# Altium schematic sheet Sheet1.SchDoc
size 431 x 279 mm; SheetNumber: 1; SheetTotal: 3
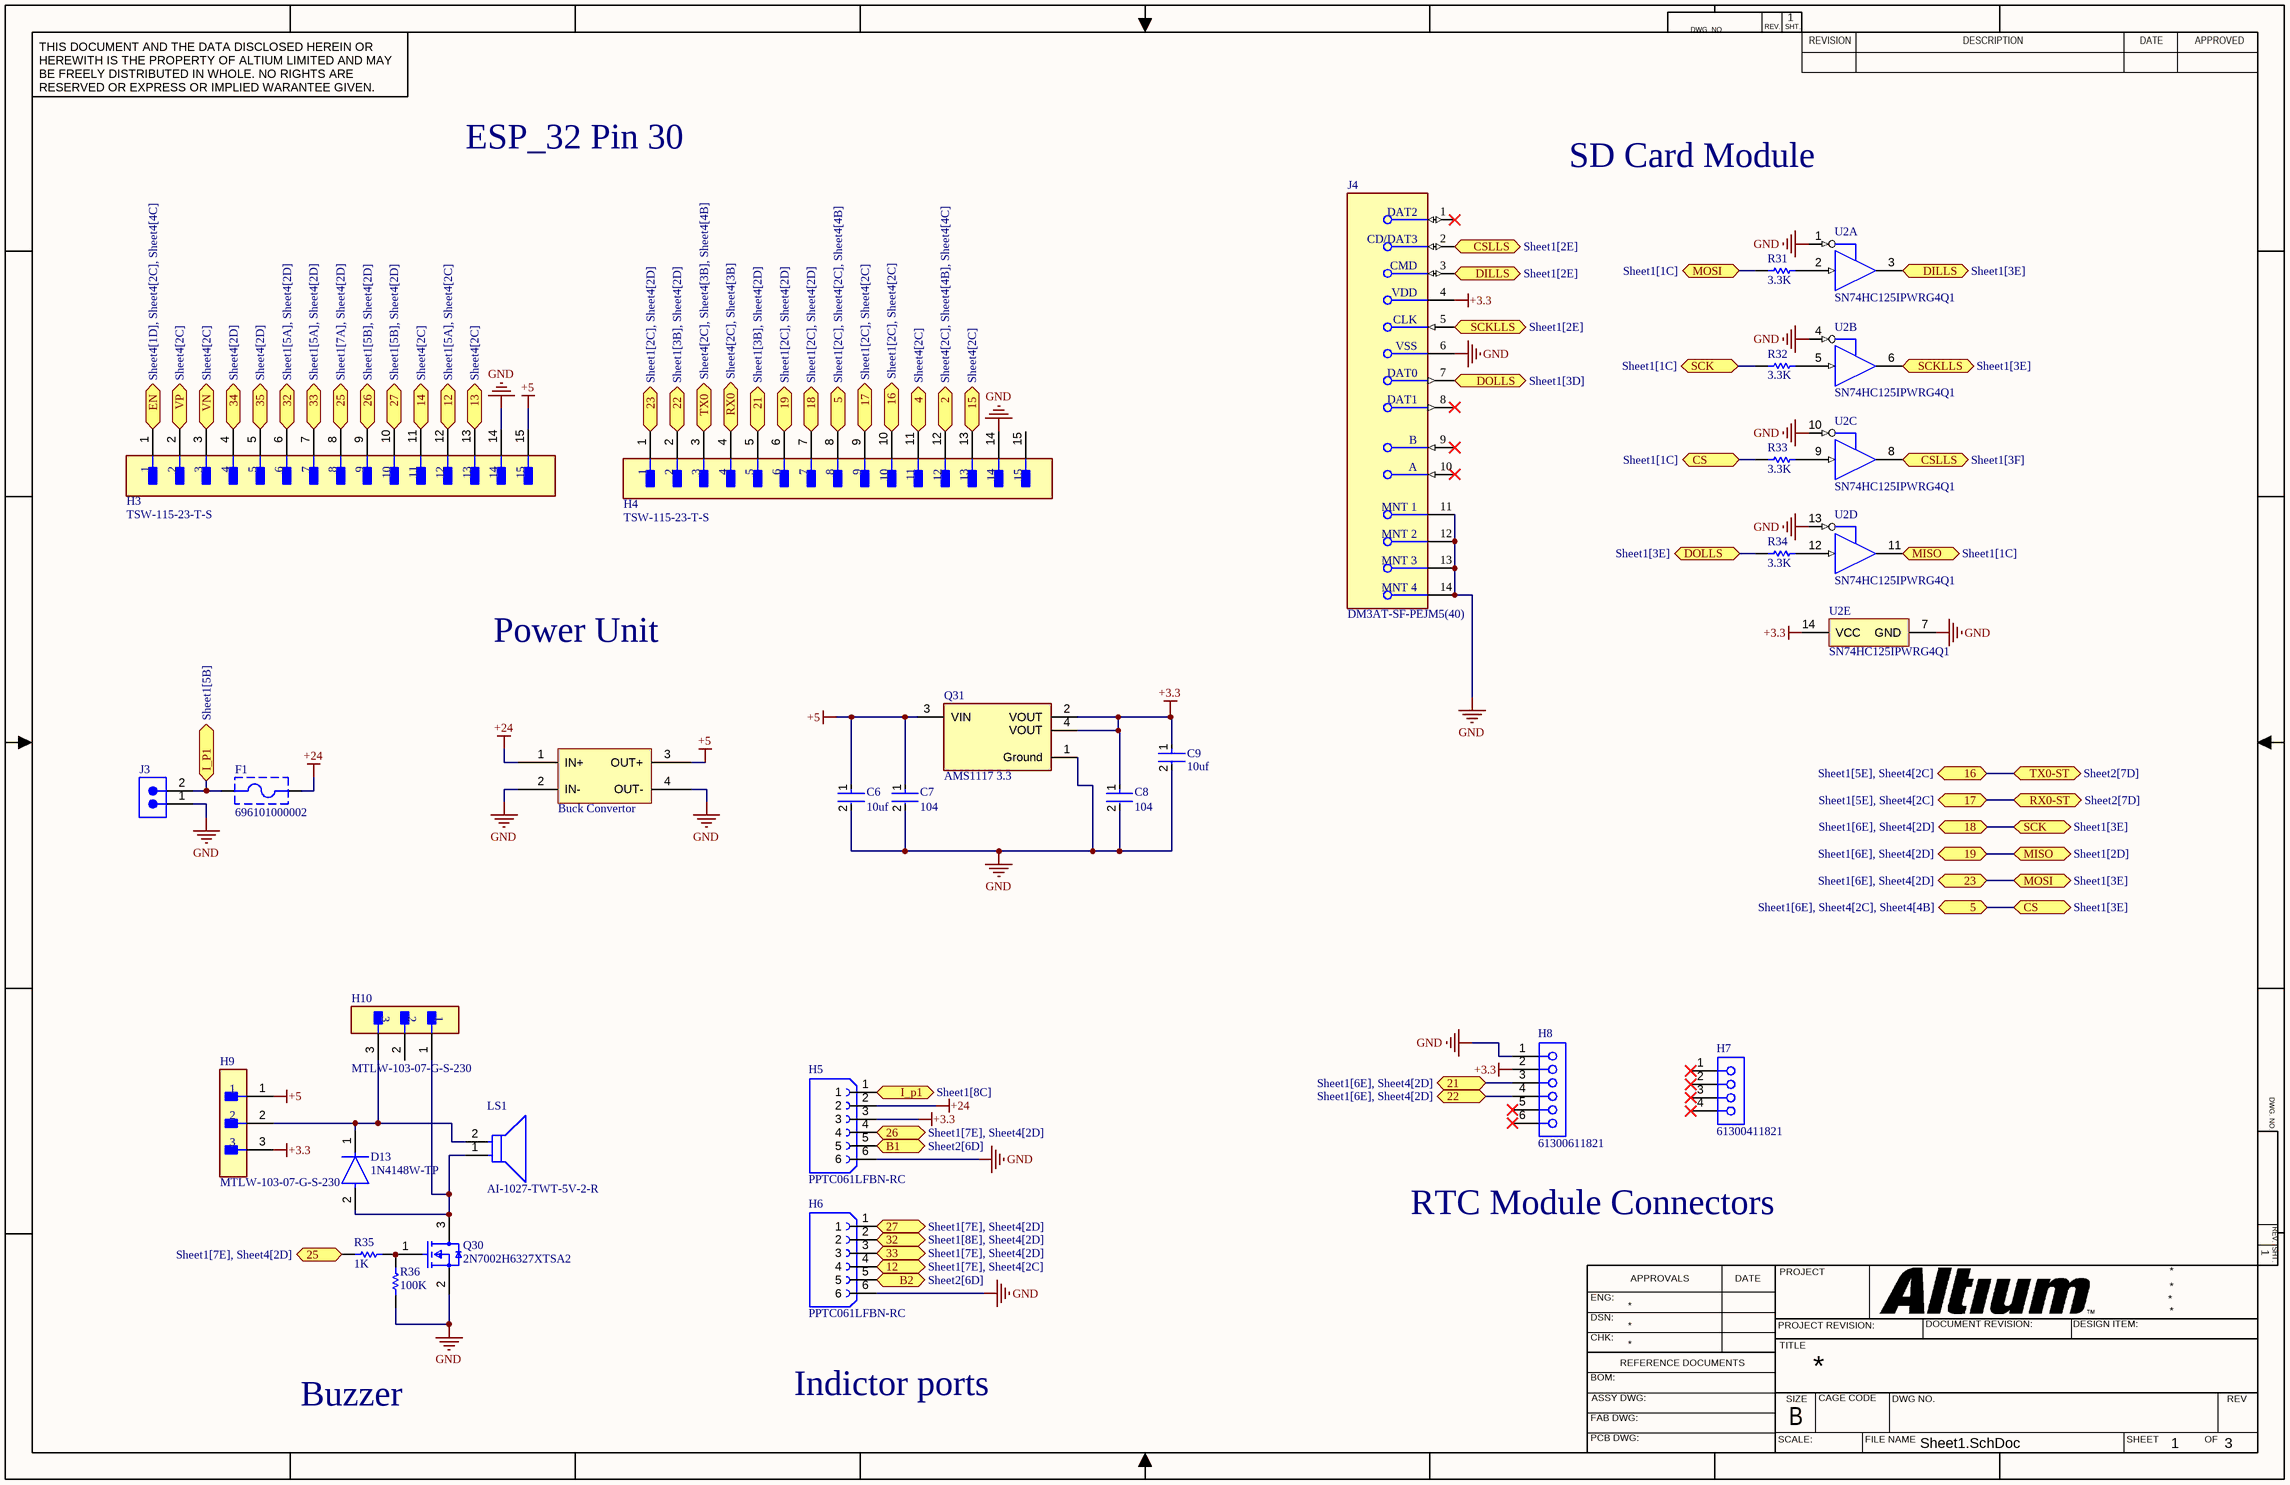
[diagram p0: Sheet1.SchDoc]

## Parts
*  Buck Convertor  [PCBComponent_1]
C6  10uf  [FP-GRM21B-0_1-MFG]
C7  104  [FP-GRM21B-0_1-MFG]
C8  104  [FP-GRM21B-0_1-MFG]
C9  10uf  [FP-GRM21B-0_1-MFG]
D13  1N4148W-TP  [FP-SOD-123-IPC_C]
F1  696101000002  [696101000002]
H3  TSW-115-23-T-S  [FP-TSW-115-23-T-S-MFG]
H4  TSW-115-23-T-S  [FP-TSW-115-23-T-S-MFG]
H5  PPTC061LFBN-RC  [SULLINS_PPTC061LFBN-RC]
H6  PPTC061LFBN-RC  [SULLINS_PPTC061LFBN-RC]
H7  61300411821  [61300411821]
H8  61300611821  [61300611821]
H9  MTLW-103-07-G-S-230  [FP-MTLW-103-07-G-S-230-MFG]
H10  MTLW-103-07-G-S-230  [FP-MTLW-103-07-G-S-230-MFG]
J3  691313510002  [691313510002]  (value not drawn)
J4  DM3AT-SF-PEJM5(40)  [FP-DM3AT-SF-PEJM5_40-MFG]
LS1  AI-1027-TWT-5V-2-R  [FP-AI-1027-TWT-5V-2-R-MFG]
Q30  2N7002H6327XTSA2  [FP-PG-SOT23-3-IPC_B]
Q31  AMS1117 3.3  [FP-AMS1117-IPC_A]
R31  3.3K  [RESC2013X70X40NL20T20]
R32  3.3K  [RESC2013X70X40NL20T20]
R33  3.3K  [RESC2013X70X40NL20T20]
R34  3.3K  [RESC2013X70X40NL20T20]
R35  1K  [RESC2013X70X40NL20T20]
R36  100K  [RESC2013X70X40NL20T20]
U2  SN74HC125IPWRG4Q1  [PW0014A_L]  (parts A,B,C,D,E of 5)

## Ports
2 (bidir, see Sheet4[2C], Sheet4[4B], Sheet4[4C]), 4 (bidir, see Sheet4[2C]), 5 (bidir, see Sheet1[2C], Sheet4[2C], Sheet4[4B]), 5 (bidir, see Sheet1[6E], Sheet4[2C], Sheet4[4B]), 12 (bidir, see Sheet1[5A], Sheet4[2C]), 12 (bidir, see Sheet1[7E], Sheet4[2C]), 13 (bidir, see Sheet4[2C]), 14 (bidir, see Sheet4[2C]), 15 (bidir, see Sheet4[2C]), 16 (bidir, see Sheet1[2C], Sheet4[2C]), 16 (bidir, see Sheet1[5E], Sheet4[2C]), 17 (bidir, see Sheet1[2C], Sheet4[2C]), 17 (bidir, see Sheet1[5E], Sheet4[2C]), 18 (bidir, see Sheet1[2C], Sheet4[2D]), 18 (bidir, see Sheet1[6E], Sheet4[2D]), 19 (bidir, see Sheet1[2C], Sheet4[2D]), 19 (bidir, see Sheet1[6E], Sheet4[2D]), 21 (bidir, see Sheet1[3B], Sheet4[2D]), 21 (bidir, see Sheet1[6E], Sheet4[2D]), 22 (bidir, see Sheet1[3B], Sheet4[2D]), 22 (bidir, see Sheet1[6E], Sheet4[2D]), 23 (bidir, see Sheet1[2C], Sheet4[2D]), 23 (bidir, see Sheet1[6E], Sheet4[2D]), 25 (bidir, see Sheet1[7A], Sheet4[2D]), 25 (bidir, see Sheet1[7E], Sheet4[2D]), 26 (bidir, see Sheet1[5B], Sheet4[2D]), 26 (bidir, see Sheet1[7E], Sheet4[2D]), 27 (bidir, see Sheet1[5B], Sheet4[2D]), 27 (bidir, see Sheet1[7E], Sheet4[2D]), 32 (bidir, see Sheet1[5A], Sheet4[2D]), 32 (bidir, see Sheet1[8E], Sheet4[2D]), 33 (bidir, see Sheet1[5A], Sheet4[2D]), 33 (bidir, see Sheet1[7E], Sheet4[2D]), 34 (bidir, see Sheet4[2D]), 35 (bidir, see Sheet4[2D]), B1 (bidir, see Sheet2[6D]), B2 (bidir, see Sheet2[6D]), CS (bidir, see Sheet1[1C]), CS (bidir, see Sheet1[3E]), CSLLS (bidir, see Sheet1[2E]), CSLLS (bidir, see Sheet1[3F]), DILLS (bidir, see Sheet1[2E]), DILLS (bidir, see Sheet1[3E]), DOLLS (bidir, see Sheet1[3D]), DOLLS (bidir, see Sheet1[3E]), EN (bidir, see Sheet4[1D], Sheet4[2C], Sheet4[4C]), I_P1 (bidir, see Sheet1[5B]), I_p1 (bidir, see Sheet1[8C]), MISO (bidir, see Sheet1[1C]), MISO (bidir, see Sheet1[2D]), MOSI (bidir, see Sheet1[1C]), MOSI (bidir, see Sheet1[3E]), RX0 (bidir, see Sheet4[2C], Sheet4[3B]), RX0-ST (bidir, see Sheet2[7D]), SCK (bidir, see Sheet1[1C]), SCK (bidir, see Sheet1[3E]), SCKLLS (bidir, see Sheet1[2E]), SCKLLS (bidir, see Sheet1[3E]), TX0 (bidir, see Sheet4[2C], Sheet4[3B], Sheet4[4B]), TX0-ST (bidir, see Sheet2[7D]), VN (bidir, see Sheet4[2C]), VP (bidir, see Sheet4[2C])

## Nets
+3.3: C8.1 C9.1 H5.3 H8.2 H9.3 J4.4(VDD) Q31.2(VOUT) Q31.4(VOUT) U2.14(VCC)
+5: *.3(OUT+) C6.1 C7.1 H3.15 H9.1 Q31.3(VIN)
+24: *.1(IN+) F1.2 H5.2
GND: *.2(IN-) *.4(OUT-) C6.2 C7.2 C8.2 C9.2 H3.14 H4.14 H5.6 H6.6 H8.1 J3.1 J4.6(VSS) J4.11(MNT_1) J4.12(MNT_2) J4.13(MNT_3) J4.14(MNT_4) Q30.2(source) Q31.1(Ground) R36.2 U2.1(1~{OE}) U2.4(2~{OE}) U2.7(GND) U2.10(3~{OE}) U2.13(4~{OE})
2: H4.12 ; port 2
4: H4.11 ; port 4
5: H4.8 R33.2 ; port 5, port CS
12: H3.12 H6.4 ; port 12
13: H3.13 ; port 13
14: H3.11 ; port 14
15: H4.13 ; port 15
16: H4.10 ; port 16, port TX0-ST
17: H4.9 ; port 17, port RX0-ST
18: H4.7 R32.2 ; port 18, port SCK
19: H4.6 U2.11(4Y) ; port 19, port MISO
21: H4.5 H8.3 ; port 21
22: H4.2 H8.4 ; port 22
23: H4.1 R31.2 ; port 23, port MOSI
25: H3.8 R35.2 ; port 25
26: H3.9 H5.4 ; port 26
27: H3.10 H6.1 ; port 27
32: H3.6 H6.2 ; port 32
33: H3.7 H6.3 ; port 33
34: H3.4 ; port 34
35: H3.5 ; port 35
B1: H5.5 ; port B1
B2: H6.5 ; port B2
CSLLS: J4.2(CD/DAT3) U2.8(3Y) ; port CSLLS
DILLS: J4.3(CMD) U2.3(1Y) ; port DILLS
DOLLS: J4.7(DAT0) R34.2 ; port DOLLS
EN: H3.1 ; port EN
I_P1: F1.1 H5.1 J3.2 ; port I_P1, port I_p1
RX0: H4.4 ; port RX0
SCKLLS: J4.5(CLK) U2.6(2Y) ; port SCKLLS
TX0: H4.3 ; port TX0
VN: H3.3 ; port VN
VP: H3.2 ; port VP
NetD13_1: D13.1(C) H9.2 H10.3 LS1.2(A)
NetD13_2: D13.2(A) H10.1 LS1.1(C) Q30.3(drain)
NetQ30_1: Q30.1(gate) R35.1 R36.1
NetR31_1: R31.1 U2.2(1A)
NetR32_1: R32.1 U2.5(2A)
NetR33_1: R33.1 U2.9(3A)
NetR34_1: R34.1 U2.12(4A)

Not connected (* = marked no-connect by the designer): H4 15; H7 1* 2* 3* 4*; H8 5* 6*; H10 2; J4 1(DAT2)* 8(DAT1)* 9(B)* 10(A)*

## Notes on the sheet
- ESP_32 Pin 30
- SD Card Module
- Power Unit
- RTC Module Connectors
- Buzzer
- Indictor ports
- DWG. NO.
- REV.
- SHT.
- THIS DOCUMENT AND THE DATA DISCLOSED HEREIN OR HEREWITH IS THE PROPERTY OF ALTIUM LIMITED AND MAY BE FREELY DISTRIBUTED IN WHOLE. NO RIGHTS ARE RESERVED OR EXPRESS OR IMPLIED WARANTEE GIVEN.
- REVISION
- DESCRIPTION
- DATE
- APPROVED
- ENG:
- APPROVALS
- PROJECT
- DSN:
- CHK:
- REFERENCE DOCUMENTS
- PROJECT REVISION:
- TITLE
- DOCUMENT REVISION:
- DESIGN ITEM:
- BOM:
- FAB DWG:
- PCB DWG:
- ASSY DWG:
- SCALE:
- SIZE
- B
- CAGE CODE
- FILE NAME
- DWG NO.
- SHEET
- OF
- REV

## Library data of the parts
* = Component_1
C6-C9 = CMP-2007-03453-2: Chip Multilayer Ceramic Capacitors for General Purpose, 0805, 10uF, X5R, 15%, 10%, 16V; Radiation Hardening: No; Thickness: 0.053inch; Voltage Rating (DC): 16V; Lead Free: Lead Free; Package Quantity: 1; Width: 1.25mm; Case Code (Imperial): 0805; Depth: 1.25mm; Packaging: Tape and Reel; Dielectric: X5R; Max Operating Temperature: 85°C; Tolerance: 10%; Voltage Rating: 16V; Voltage: 16V; Capacitance: 10uF; Height: 1.25mm; Case Code (Metric): 2012; Material: Ceramic; Mount: Surface Mount; Case/Package: 0805; REACH SVHC: No SVHC; Length: 2mm; Min Operating Temperature: -55°C; Termination: SMD/SMT
D13 = CMP-2000-04993-2: DIODE GEN PURP 100V 150MA SOD123; Max Reverse Leakage Current: 5uA; Max Surge Current: 2A; Reverse Recovery Time: 4ns; Polarity: Standard; Capacitance: 4pF; Max Forward Surge Current (Ifsm): 1A; Element Configuration: Single; Power Dissipation: 400mW; Forward Voltage: 1V; Radiation Hardening: No; Lead Free: Lead Free; Max Reverse Voltage (DC): 100V; Current Rating: 150mA; Forward Current: 150mA; Packaging: Tape and Reel; Number of Pins: 2; Package Quantity: 3000; Max Operating Temperature: 150°C; Min Operating Temperature: -65°C; Average Rectified Current: 150mA; Recovery Time: 4ns; Output Current: 150mA; Peak Non-Repetitive Surge Current: 2A; Width: 1.8mm; Voltage Rating (DC): 100V; Height: 1.2mm; Max Repetitive Reverse Voltage (Vrrm): 100V; Mount: Surface Mount; Length: 2.85mm
F1 = CMP-1502-00233-4: WR-FSH Fuse Holder Blocks Fuse Holder Blocks Clip Cover for PCB; Fuse Current: 10A; Voltage Rating (AC): 250V; Mount: Through Hole; REACH SVHC: Unknown; RoHS: Compliant; Height: 13.6mm; Packaging: Box; Min Operating Temperature: -30°C; Max Operating Temperature: 120°C
H3 H4 = CMP-02766-001466-1: CONN HEADER VERT 15POS 2.54MM; Connector Type: Male Pin; Number of Contacts: 15; Gender: Male; Pitch: 0.1inch; Termination: Solder; Packaging: Bulk; Lead Free: Lead Free; Housing Color: Black; Housing Material: Plastic; Color: Black; RoHS Compliant: Yes; Contact Type: Male Pin; Width: 2.54mm; Mount: Through Hole; Contact Material: Bronze; Number of Rows: 1; Radiation Hardening: No; Number of Positions: 15; Length: 38.1mm; REACH SVHC: No SVHC; Height: 2.54mm; Contact Plating: Tin; Series: TSW; Contact Mating Length: 0.23inch
H5 H6 = PPTC061LFBN-RC: 6 Position Total Single Row 2.54 mm Pitch Straight Female Header; MF: Sullins Connector Solutions; MP: PPTC061LFBNRC; SnapEDA_Link: https://www.snapeda.com/parts/PPTC061LFBNRC/Sullins/view-part/?ref=snap; Package: None; Value: *; Check_prices: https://www.snapeda.com/parts/PPTC061LFBNRC/Sullins/view-part/?ref=eda
H7 = CMP-1502-01316-3: NexarPartId: 61924712; Contact Resistance: 20mΩ; Gender: Female; Current Rating: 3A; Operating Supply Voltage: 250V; RoHS: Non-Compliant; Number of Pins: 4; Orientation: Vertical; Lead Pitch: 2.54mm
H8 = CMP-1502-01322-3: NexarPartId: 21642411; Current Rating: 3A; Operating Supply Voltage: 250V; Contact Resistance: 20mΩ; Gender: Female; Number of Pins: 6; Orientation: Vertical; Lead Pitch: 2.54mm; RoHS: Compliant
H9 H10 = CMP-02766-001679-1: CONN HEADER VERT 3POS 2.54MM; Max Current Rating: 3A; Number of Contacts: 3; Gender: Male; Contact Material: Bronze; Pitch: 2.54mm; Housing Material: Polymer; Contact Plating: Gold; Radiation Hardening: No; Depth: 2.48mm; Packaging: Bulk; Number of Rows: 1; Max Operating Temperature: 125°C; Housing Color: Black; Termination: Solder; Min Operating Temperature: -55°C; Length: 7.62mm; RoHS Compliant: Yes; Orientation: Straight
J3 = CMP-1502-02192-3: 313; 5.08MM Pitch Straight Pluggable Term Block, Pcb Header, Through Hole, 2 Way; Number of Contacts: 2; Voltage: 300V; Number of Levels: 1; Gender: Male; Current: 20A; Pitch: 5.08mm; Number of Pins: 2; RoHS: Compliant; Length: 11.5mm; Width: 12.16mm; Packaging: Box; Max Operating Temperature: 105°C; Lead Pitch: 5.08mm; Mount: Through Hole; Color: Green; Number of Rows: 1; Voltage Rating: 300V; Contact Material: Tin; Height: 8.7mm; Contact Plating: Tin; Termination: Solder; Min Operating Temperature: -40°C; Number of Positions Per Level: 2; Current Rating: 20A
J4 = CMP-11597-000006-1: CONN MICRO SD R/A PUSH-PUSH SMD; Contact Resistance: 100mR; Insulation Resistance: 1GR; Gender: Receptacle; Max Voltage Rating (AC): 125V; Pitch: 1.1mm; Mating Cycles: 10000; Max Current Rating: 500mA; Connector Type: Connector; Number of Contacts: 8; Housing Material: Polymer; Flammability Rating: UL94 V-0; REACH SVHC: No SVHC; Lead Free: Lead Free; Package Quantity: 400; Length: 13.85mm; Number of Rows: 2; Series: DM3; Min Operating Temperature: -25°C; Voltage Rating (AC): 125V; Contact Material: Copper Alloy; Depth: 15.95mm; Contact Plating: Gold; Packaging: Tape and Reel; Width: 13.85mm; Orientation: Right Angle; Color: Black; Voltage Rating: 125V; Radiation Hardening: No; Termination: Solder; Current Rating: 500mA; Mount: Surface Mount; Max Operating Temperature: 85°C
LS1 = CMP-103888-000002-1: AUDIO MAGNETIC INDICATOR 3-7V TH; Input Type: DC; Frequency: 2.73kHz; Max Supply Voltage (DC): 7V; Max Supply Current: 30mA; Voltage Rating: 5V; Min Supply Voltage (DC): 3V; Max Operating Temperature: 70°C; Height: 5mm; Series: AI; Mount: Through Hole; Sensing Method: Magnetic; Packaging: Tray; Diameter: 9.6mm; Contact Plating: Gold; Termination: PC Pins; Operating Supply Current: 30mA; Min Operating Temperature: -20°C
Q30 = CMP-32901-000180-1: MOSFET N-CH 60V 0.3A SOT23; Rise Time: 3.3ns; Input Capacitance: 20pF; Rds On Max: 3R; Gate to Source Voltage (Vgs): 20V; Continuous Drain Current (ID): 300mA; Max Power Dissipation: 500mW; Packaging: Tape and Reel; Mount: Surface Mount; Case/Package: SOT-23; Drain to Source Voltage (Vdss): 60V; Min Operating Temperature: -55°C; Halogen Free: Halogen Free; Max Dual Supply Voltage: 60V; Number of Pins: 3; Lead Free: Lead Free; Max Operating Temperature: 150°C
Q31 = CMP-209535-000001-1: LDO Voltage Regulators 1A, 3.3V; Manufacturer Part Number: AMS1117-3.3; Manufacturer: Advanced Monolithic Systems; Dropout Voltage: 1.1V; Output Type: Fixed; Nominal Supply Current: 5mA; Max Power Dissipation: 1.2W; Max Supply Voltage: 15V; Number Of Outputs: 1; Standoff Height: 0.64mm; Max Junction Temp: +125°C; Height: 1.8mm; Package: AMS1117; Device Class L2: Power Management ICs; ComponentLink2Description: Datasheet; ComponentLink2URL: http://www.advanced-monolithic.com/pdf/ds1117.pdf; Category: IC; RoHS: TRUE; Automotive: No; Device Class L1: Integrated Circuits (ICs); Output Current: 1A; Device Class L3: Voltage Regulators - Linear; Temperature: -40°C to +125°C; Output Voltage: 3.3V; Temperature Range Low: -40°C; Octopart: https://octopart.com/ams1117-3.3-advanced+monolithic+systems-25899300; Lead Free: Yes; Ipc Land Pattern Name: SOT229P700X180-4; Temperature Range High: +125°C
R31-R36 = CMP-2001-04376-1: Manufacturer: Panasonic; Part Number: ERJ-6ENF1002V
U2 = CMP-0440-00197-3: Automotive Catalog Quadruple Bus Buffer Gates With 3-State Outputs, PW0014A, LARGE T&R; Generic Part Number: SN74HC125-Q1; Manufacturer: Texas Instruments; VCC(Min)(V): 2; tpd @ Nom Voltage(Max)(ns): 26; Input Type: CMOS; VCC(Max)(V): 6; Bits(#): 4; F @ Nom Voltage(Max)(Mhz): 28; ICC @ Nom Voltage(Max)(mA): 0.016; PackageVersion: http://www.ti.com/lit/ml/mpds360/mpds360.pdf; Operating Temperature Range(C): -40 to 85; PackageReference: PW0014A; Rating: Automotive; Voltage(Nom)(V): 6; DatasheetVersion: SCLS574A; Code_JEDEC: MO-153; Output Type: CMOS